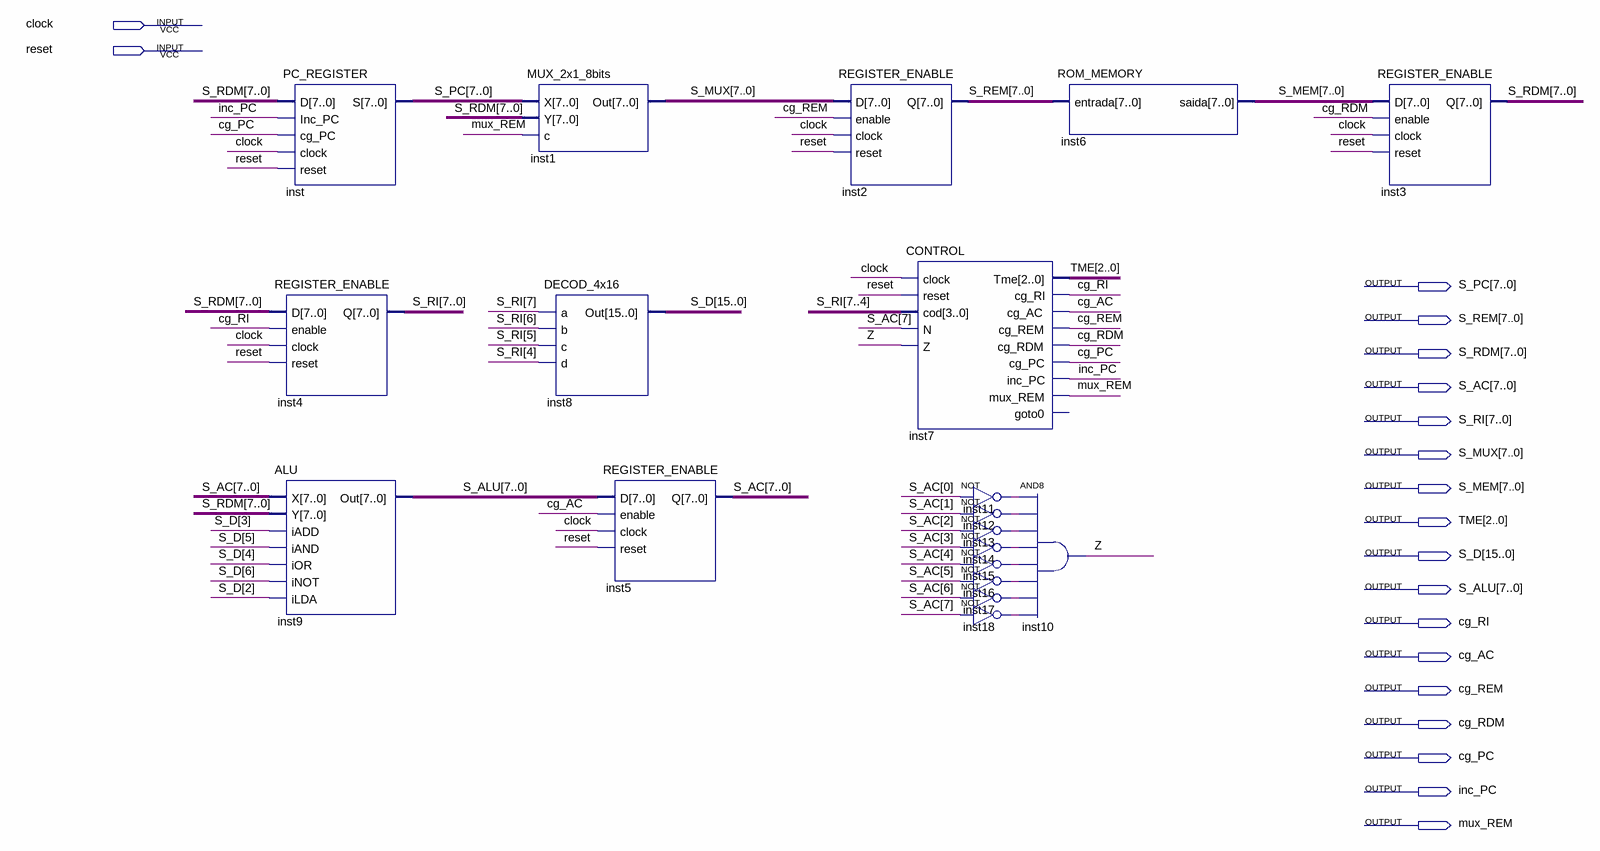
[diagram p0: schematic sheet]
// Quartus schematic NEANDER.bdf as structural Verilog: 19 symbols, 19 pins
module NEANDER (
  input  clock,
  input  reset,
  output [7:0] S_PC,
  output [7:0] S_REM,
  output [7:0] S_RDM,
  output [7:0] S_AC,
  output [7:0] S_RI,
  output [7:0] S_MUX,
  output [7:0] S_MEM,
  output [2:0] TME,
  output [15:0] S_D,
  output [7:0] S_ALU,
  output cg_RI,
  output cg_AC,
  output cg_REM,
  output cg_RDM,
  output cg_PC,
  output inc_PC,
  output mux_REM
);

  wire inst11_out, inst12_out, inst13_out, inst14_out, inst15_out, inst16_out, inst17_out, inst18_out, Z;

  PC_REGISTER inst (.D(S_RDM), .Inc_PC(inc_PC), .cg_PC(cg_PC), .clock(clock), .reset(reset), .S(S_PC));
  REGISTER_ENABLE inst4 (.D(S_RDM), .enable(cg_RI), .clock(clock), .reset(reset), .Q(S_RI));
  ALU inst9 (
    .X(S_AC), .Y(S_RDM), .iADD(S_D[3]), .iAND(S_D[5]), .iOR(S_D[4]), .iNOT(S_D[6]), .iLDA(S_D[2]), .Out(S_ALU));
  MUX_2x1_8bits inst1 (.X(S_PC), .Y(S_RDM), .c(mux_REM), .Out(S_MUX));
  DECOD_4x16 inst8 (.a(S_RI[7]), .b(S_RI[6]), .c(S_RI[5]), .d(S_RI[4]), .Out(S_D));
  REGISTER_ENABLE inst5 (.D(S_ALU), .enable(cg_AC), .clock(clock), .reset(reset), .Q(S_AC));
  REGISTER_ENABLE inst2 (.D(S_MUX), .enable(cg_REM), .clock(clock), .reset(reset), .Q(S_REM));
  CONTROL inst7 (
    .clock(clock), .reset(reset), .cod(S_RI[7:4]), .N(S_AC[7]), .Z(Z), .Tme(TME), .cg_RI(cg_RI),
    .cg_AC(cg_AC), .cg_REM(cg_REM), .cg_RDM(cg_RDM), .cg_PC(cg_PC), .inc_PC(inc_PC), .mux_REM(mux_REM));  // open: goto0
  not inst11 (inst11_out, S_AC[0]);
  not inst12 (inst12_out, S_AC[1]);
  not inst13 (inst13_out, S_AC[2]);
  not inst14 (inst14_out, S_AC[3]);
  not inst15 (inst15_out, S_AC[4]);
  not inst16 (inst16_out, S_AC[5]);
  not inst17 (inst17_out, S_AC[6]);
  not inst18 (inst18_out, S_AC[7]);
  ROM_MEMORY inst6 (.entrada(S_REM), .saida(S_MEM));
  and inst10 (Z, inst11_out, inst12_out, inst13_out, inst14_out, inst15_out, inst16_out, inst17_out, inst18_out);
  REGISTER_ENABLE inst3 (.D(S_MEM), .enable(cg_RDM), .clock(clock), .reset(reset), .Q(S_RDM));
endmodule
